# EAGLE design HCTL200_2axis (EAGLE 7.1.0)
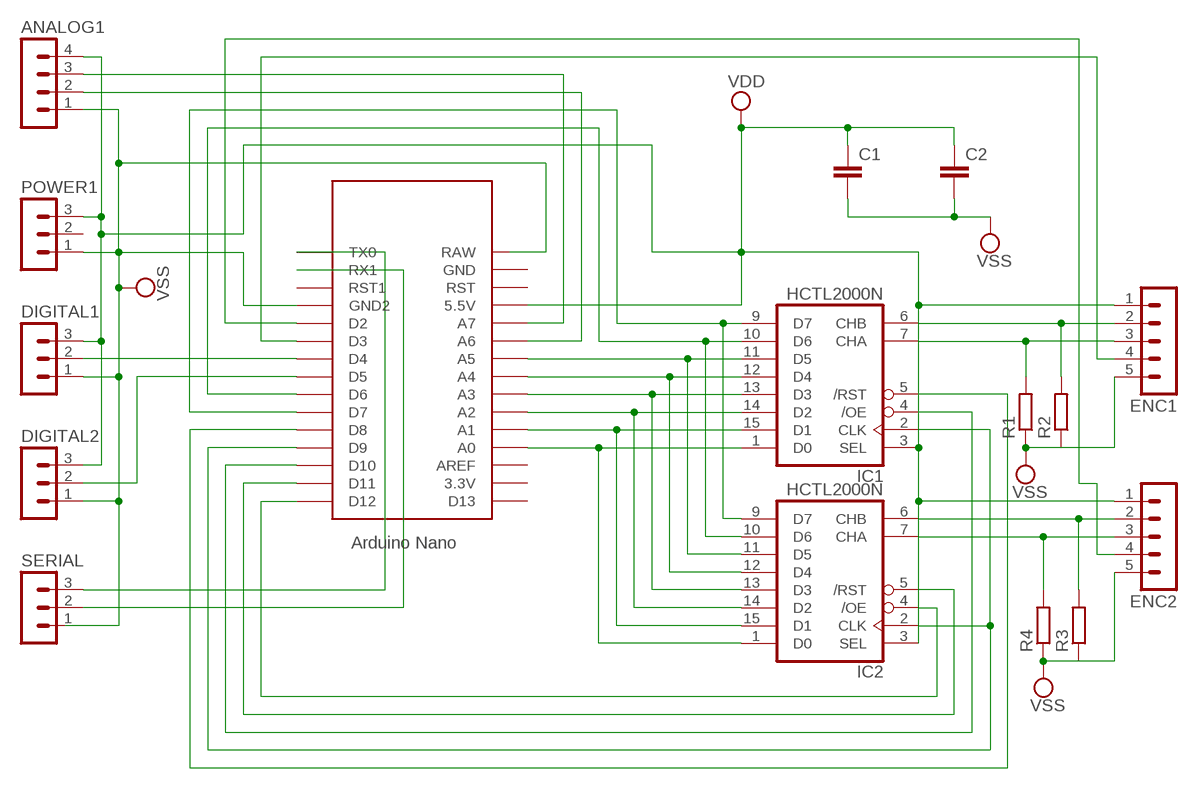
[diagram p0: schematic, sheet 1]

## Parts
ANALOG1  MA04-1  [MA04-1]
C1  C-EU025-030X050  [C025-030X050]
C2  C-EU025-030X050  [C025-030X050]
DIGITAL1  MA03-1  [MA03-1]
DIGITAL2  MA03-1  [MA03-1]
ENC1  MA05-1  [MA05-1]
ENC2  MA05-1  [MA05-1]
IC1  HCTL2000N  [DIL16]
IC2  HCTL2000N  [DIL16]
POWER1  MA03-1  [MA03-1]
R1  R-EU_0204/7  [0204/7]
R2  R-EU_0204/7  [0204/7]
R3  R-EU_0204/7  [0204/7]
R4  R-EU_0204/7  [0204/7]
SERIAL  MA03-1  [MA03-1]
U$1  NANO  [NANO]

## Nets
N$1: IC1.2(CLK) IC2.2(CLK) U$1.D9
N$2: IC1.5(/RST) U$1.D8
N$3: IC1.1(D0) IC2.1(D0) U$1.A0
N$4: IC1.15(D1) IC2.15(D1) U$1.A1
N$5: IC1.14(D2) IC2.14(D2) U$1.A2
N$6: IC1.13(D3) IC2.13(D3) U$1.A3
N$7: IC1.12(D4) IC2.12(D4) U$1.A4
N$8: IC1.11(D5) IC2.11(D5) U$1.A5
N$9: IC1.10(D6) IC2.10(D6) U$1.D6
N$10: IC1.9(D7) IC2.9(D7) U$1.D7
N$11: ENC1.4 U$1.D3
N$12: ENC1.2 IC1.6(CHB) R2.2
N$13: ENC1.3 IC1.7(CHA) R1.2
N$14: ENC2.2 IC2.6(CHB) R3.2
N$15: ENC2.3 IC2.7(CHA) R4.2
N$16: IC2.5(/RST) U$1.D11
N$17: IC1.4(/OE) U$1.D10
N$18: IC2.4(/OE) U$1.D12
N$19: ENC2.4 U$1.D2
N$20: DIGITAL1.2 U$1.D4
N$21: DIGITAL2.2 U$1.D5
N$22: ANALOG1.2 U$1.A6
N$23: ANALOG1.3 U$1.A7
N$28: SERIAL.2 U$1.RX1
N$29: SERIAL.3 U$1.TX0
VDD: ANALOG1.4 C1.1 C2.1 DIGITAL1.3 DIGITAL2.3 ENC1.1 ENC2.1 IC1.3(SEL) IC2.3(SEL) POWER1.3 U$1.5V(5.5V)
VSS: ANALOG1.1 C1.2 C2.2 DIGITAL1.1 DIGITAL2.1 ENC1.5 ENC2.5 POWER1.1 R1.1 R2.1 R3.1 R4.1 U$1.GND1(GND2)
Unconnected: POWER1.2 SERIAL.1 U$1.3.3V U$1.AREF U$1.D13 U$1.GND U$1.ICSP1 U$1.ICSP2 U$1.ICSP3 U$1.ICSP4 U$1.ICSP5 U$1.ICSP6 U$1.RAW U$1.RST U$1.RST1

## Power pins joined to a net without a drawn wire
VDD: IC1.16(VDD) IC2.16(VDD)
VSS: IC1.8(VSS) IC2.8(VSS)

## Library data of the parts
ANALOG1 = con-lstb:MA04-1: PIN HEADER; OC_FARNELL: unknown; OC_NEWARK: unknown
C1 C2 = rcl:C-EU: CAPACITOR, European symbol
DIGITAL1 DIGITAL2 POWER1 SERIAL = con-lstb:MA03-1: PIN HEADER; OC_FARNELL: unknown; OC_NEWARK: unknown
ENC1 ENC2 = con-lstb:MA05-1: PIN HEADER; OC_FARNELL: unknown; OC_NEWARK: unknown
IC1 IC2 = HCTL2000:HCTL2000: 4-bit parallel in/out SHIFT REGISTER
R1-R4 = rcl:R-EU_: RESISTOR, European symbol
U$1 = Arduino-clone:NANO: Arduino Nano

## Board
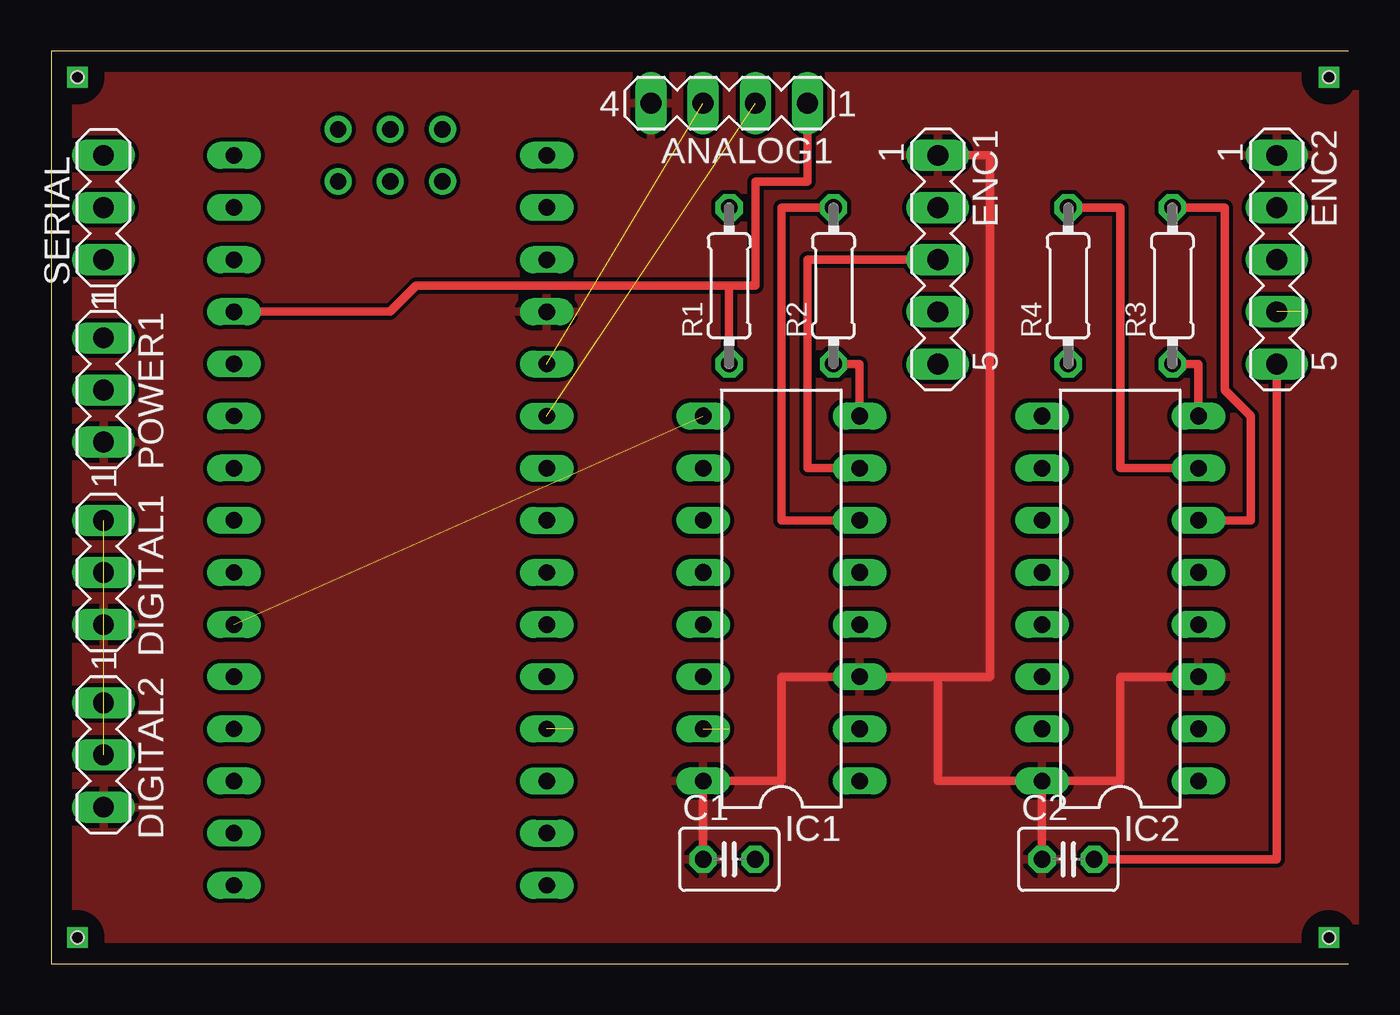
[diagram p1: board, top side]
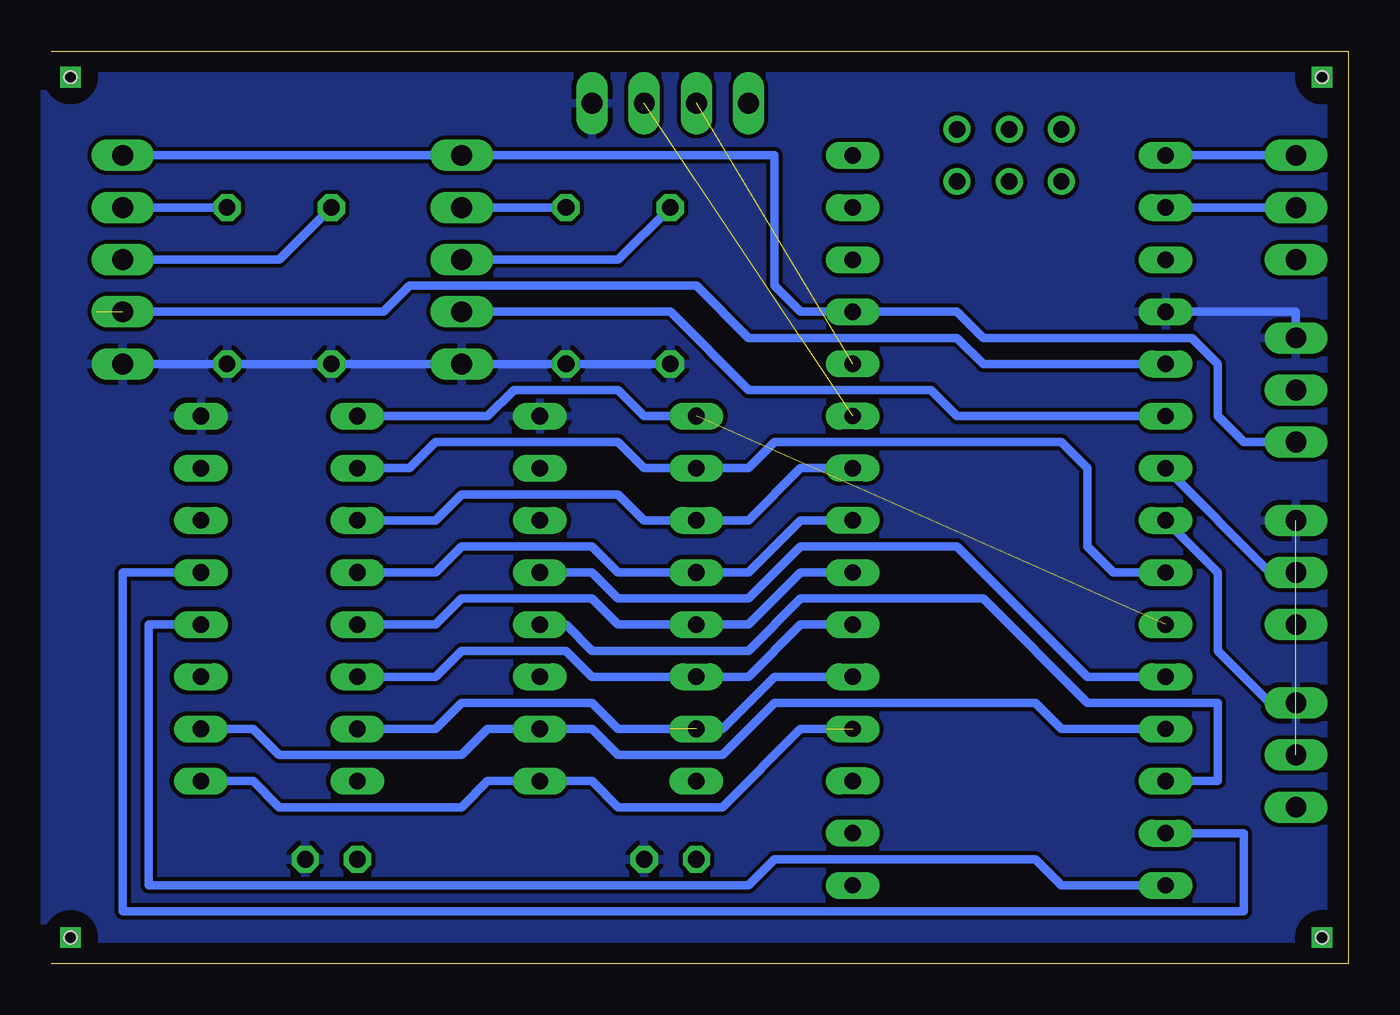
[diagram p2: board, bottom side, seen from below]

Size 63.17 x 44.44 mm. Coordinates in mm from the lower left corner, seen from the top.
Outline: 63.17,0 0,0 0,44.44 63.17,44.44
Copper layers (1*16): Top 0.035mm / dielectric 1.5mm / Bottom 0.035mm
Design rules "default": minimum track width 10mil, minimum drill 24mil, track to track 8mil, track to pad 8mil, pad to pad 8mil, via to via 8mil, smd to smd 8mil, copper to edge 40mil, drill to drill 8mil, minimum pad ring 10mil, minimum via ring 8mil, stop-mask expansion 4mil, vias tented up to drill 0mil, thermal gap 10mil
Holes 0.6 mm at 1.27,43.18 62.23,43.18 62.23,1.27 1.27,1.27

### Footprints (pad centres in the part's own frame; a part is rotated, then mirrored left to right if it is on the bottom)
MA04-1 = drill 1.016 long: 1 -3.81,0; 2 -1.27,0; 3 1.27,0; 4 3.81,0
C025-030X050 = drill 0.813 octagon: 1 -1.27,0; 2 1.27,0
MA03-1 = drill 1.016 long: 1 -2.54,0; 2 0,0; 3 2.54,0
MA05-1 = drill 1.016 long: 1 -5.08,0; 2 -2.54,0; 3 0,0; 4 2.54,0; 5 5.08,0
DIL16 = drill 0.813 long: 1 -8.89,-3.81; 2 -6.35,-3.81; 3 -3.81,-3.81; 4 -1.27,-3.81; 5 1.27,-3.81; 6 3.81,-3.81; 7 6.35,-3.81; 8 8.89,-3.81; 9 8.89,3.81; 10 6.35,3.81; 11 3.81,3.81; 12 1.27,3.81; 13 -1.27,3.81; 14 -3.81,3.81; 15 -6.35,3.81; 16 -8.89,3.81
0204/7 = drill 0.813 octagon: 1 -3.81,0; 2 3.81,0
NANO = drill 0.8 long: 3.3V -10.16,24.13; 5V -10.16,-1.27; A0 -10.16,19.05; A1 -10.16,16.51; A2 -10.16,13.97; A3 -10.16,11.43; A4 -10.16,8.89; A5 -10.16,6.35; A6 -10.16,3.81; A7 -10.16,1.27; AREF -10.16,21.59; D2 5.08,1.27; D3 5.08,3.81; D4 5.08,6.35; D5 5.08,8.89; D6 5.08,11.43; D7 5.08,13.97; D8 5.08,16.51; D9 5.08,19.05; D10 5.08,21.59; D11 5.08,24.13; D12 5.08,26.67; D13 -10.16,26.67; GND -10.16,-6.35; GND1 5.08,-1.27; RAW -10.16,-8.89; RST -10.16,-3.81; RST1 5.08,-3.81; RX1 5.08,-6.35; TX0 5.08,-8.89 | drill 0.8: ICSP1 -5.08,-10.16; ICSP2 -5.08,-7.62; ICSP3 -2.54,-10.16; ICSP4 -2.54,-7.62; ICSP5 0,-10.16; ICSP6 0,-7.62
3,0 = hole 3: 0,0

### Placement (x,y rotation side)
ANALOG1  33.02,41.91 180 top
C1  33.02,5.08 0 top
C2  49.53,5.08 0 top
DIGITAL1  2.54,19.05 270 top
DIGITAL2  2.54,10.16 270 top
ENC1  43.18,34.29 270 top
ENC2  59.69,34.29 270 top
IC1  35.56,17.78 90 top
IC2  52.07,17.78 90 top
POWER1  2.54,27.94 270 top
R1  33.02,33.02 90 top
R2  38.1,33.02 90 top
R3  54.61,33.02 90 top
R4  49.53,33.02 90 top
SERIAL  2.54,36.83 90 top
U$1  13.97,30.48 180 top
U$2  [3,0]  -7.62,40.64 0 top  (outside the outline)
U$3  [3,0]  71.12,3.81 0 top  (outside the outline)

### Tracks (layer width: path | path; a pad name or v marks a point on that pad's centre or on a via)
N$1
  Bottom 0.406: IC2.2 53.34,11.43 52.07,10.16 43.18,10.16 41.91,11.43 IC1.2 36.83,11.43 35.56,10.16 30.48,10.16 27.94,12.7 15.24,12.7 13.97,11.43 U$1.D9
N$2
  Bottom 0.406: IC1.5 36.83,19.05 35.56,17.78 29.21,17.78 26.67,20.32 19.05,20.32 12.7,13.97 U$1.D8
N$3  (1 unrouted)
  Bottom 0.406: IC2.1 53.34,8.89 52.07,7.62 43.18,7.62 41.91,8.89 IC1.1 36.83,8.89 35.56,7.62 30.48,7.62 26.67,11.43 25.4,11.43
N$4  (1 unrouted)
  Bottom 0.406: IC2.15 44.45,11.43 43.18,12.7 36.83,12.7 35.56,11.43 33.02,11.43 | IC1.15 30.48,11.43 27.94,13.97 U$1.A1
N$5
  Bottom 0.406: IC2.14 44.45,13.97 43.18,15.24 38.1,15.24 36.83,13.97 IC1.14 29.21,13.97 26.67,16.51 U$1.A2
N$6
  Bottom 0.406: IC2.13 44.45,16.51 43.18,17.78 36.83,17.78 35.56,16.51 IC1.13 29.21,16.51 26.67,19.05 U$1.A3
N$7
  Bottom 0.406: IC2.12 44.45,19.05 43.18,20.32 36.83,20.32 35.56,19.05 IC1.12 29.21,19.05 26.67,21.59 U$1.A4
N$8
  Bottom 0.406: IC2.11 44.45,21.59 43.18,22.86 35.56,22.86 34.29,21.59 IC1.11 29.21,21.59 26.67,24.13 U$1.A5
N$9
  Bottom 0.406: IC2.10 45.72,24.13 44.45,25.4 35.56,25.4 34.29,24.13 IC1.10 29.21,24.13 27.94,25.4 13.97,25.4 12.7,24.13 12.7,20.32 11.43,19.05 U$1.D6
N$10  (1 unrouted)
  Bottom 0.406: IC2.9 41.91,26.67 40.64,27.94 35.56,27.94 34.29,26.67 IC1.9
N$11
  Bottom 0.406: U$1.D3 19.05,26.67 20.32,27.94 29.21,27.94 33.02,31.75 ENC1.4
N$12
  Top 0.406: R2.2 35.56,36.83 35.56,21.59 IC1.6
  Bottom 0.406: ENC1.2 R2.2
N$13
  Top 0.406: ENC1.3 36.83,34.29 36.83,24.13 IC1.7
  Bottom 0.406: R1.2 35.56,34.29 ENC1.3
N$14
  Top 0.406: IC2.6 58.42,21.59 58.42,26.67 57.15,27.94 57.15,36.83 R3.2
  Bottom 0.406: ENC2.2 R3.2
N$15
  Top 0.406: IC2.7 52.07,24.13 52.07,36.83 R4.2
  Bottom 0.406: ENC2.3 52.07,34.29 R4.2
N$16
  Bottom 0.406: IC2.5 59.69,19.05 59.69,2.54 5.08,2.54 5.08,6.35 U$1.D11
N$17
  Bottom 0.406: IC1.4 38.1,16.51 36.83,15.24 29.21,15.24 26.67,17.78 17.78,17.78 12.7,12.7 6.35,12.7 6.35,8.89 U$1.D10
N$18
  Bottom 0.406: U$1.D12 13.97,3.81 15.24,5.08 27.94,5.08 29.21,3.81 58.42,3.81 58.42,16.51 IC2.4
N$19  (1 unrouted)
  Bottom 0.406: U$1.D2 17.78,29.21 19.05,30.48 29.21,30.48 31.75,33.02 45.72,33.02 46.99,31.75 60.96,31.75
N$20
  Bottom 0.406: DIGITAL1.2 3.81,19.05 U$1.D4
N$21  (1 unrouted)
  Bottom 0.406: U$1.D5 6.35,19.05 6.35,15.24 3.81,12.7 2.54,12.7
N$22  (1 unrouted)
N$23  (1 unrouted)
N$24  (via drill 0.6)
  other vias: 1.27,1.27
N$25  (via drill 0.6)
  other vias: 1.27,43.18
N$26  (via drill 0.6)
  other vias: 62.23,43.18
N$27  (via drill 0.6)
  other vias: 62.23,1.27
N$28
  Bottom 0.406: U$1.RX1 SERIAL.2
N$29
  Bottom 0.406: U$1.TX0 SERIAL.3
VDD
  Top 0.406: C2.1 IC2.16 | C1.1 IC1.16 35.56,8.89 35.56,13.97 IC1.3 | IC2.16 43.18,8.89 43.18,13.97 IC1.3 | IC1.3 38.1,13.97 | IC2.16 52.07,8.89 52.07,13.97 IC2.3 | IC1.3 45.72,13.97 45.72,39.37 ENC1.1
  Bottom 0.406: ENC2.1 ENC1.1 27.94,39.37 27.94,33.02 26.67,31.75 U$1.5V 19.05,31.75 17.78,30.48 7.62,30.48 6.35,29.21 6.35,26.67 5.08,25.4 POWER1.3
  pour Top: 0,44.45 63.5,44.45 63.5,0 0,0
VSS  (1 unrouted)
  Top 0.406: R2.1 39.37,29.21 IC1.8 | C2.2 59.69,5.08 ENC2.5 | IC2.8 55.88,29.21 R3.1 | U$1.GND1 16.51,31.75 17.78,33.02 33.02,33.02 | 33.02,33.02 R1.1 | 33.02,33.02 34.29,33.02 34.29,38.1 36.83,38.1 ANALOG1.1
  Bottom 0.406: U$1.GND1 2.54,31.75 POWER1.1 | R1.1 ENC2.5
  pour Bottom: 0,44.45 63.5,44.45 63.5,0 0,0